# Altium schematic sheet 2017_Carte_RUSH.SchDoc
size A4
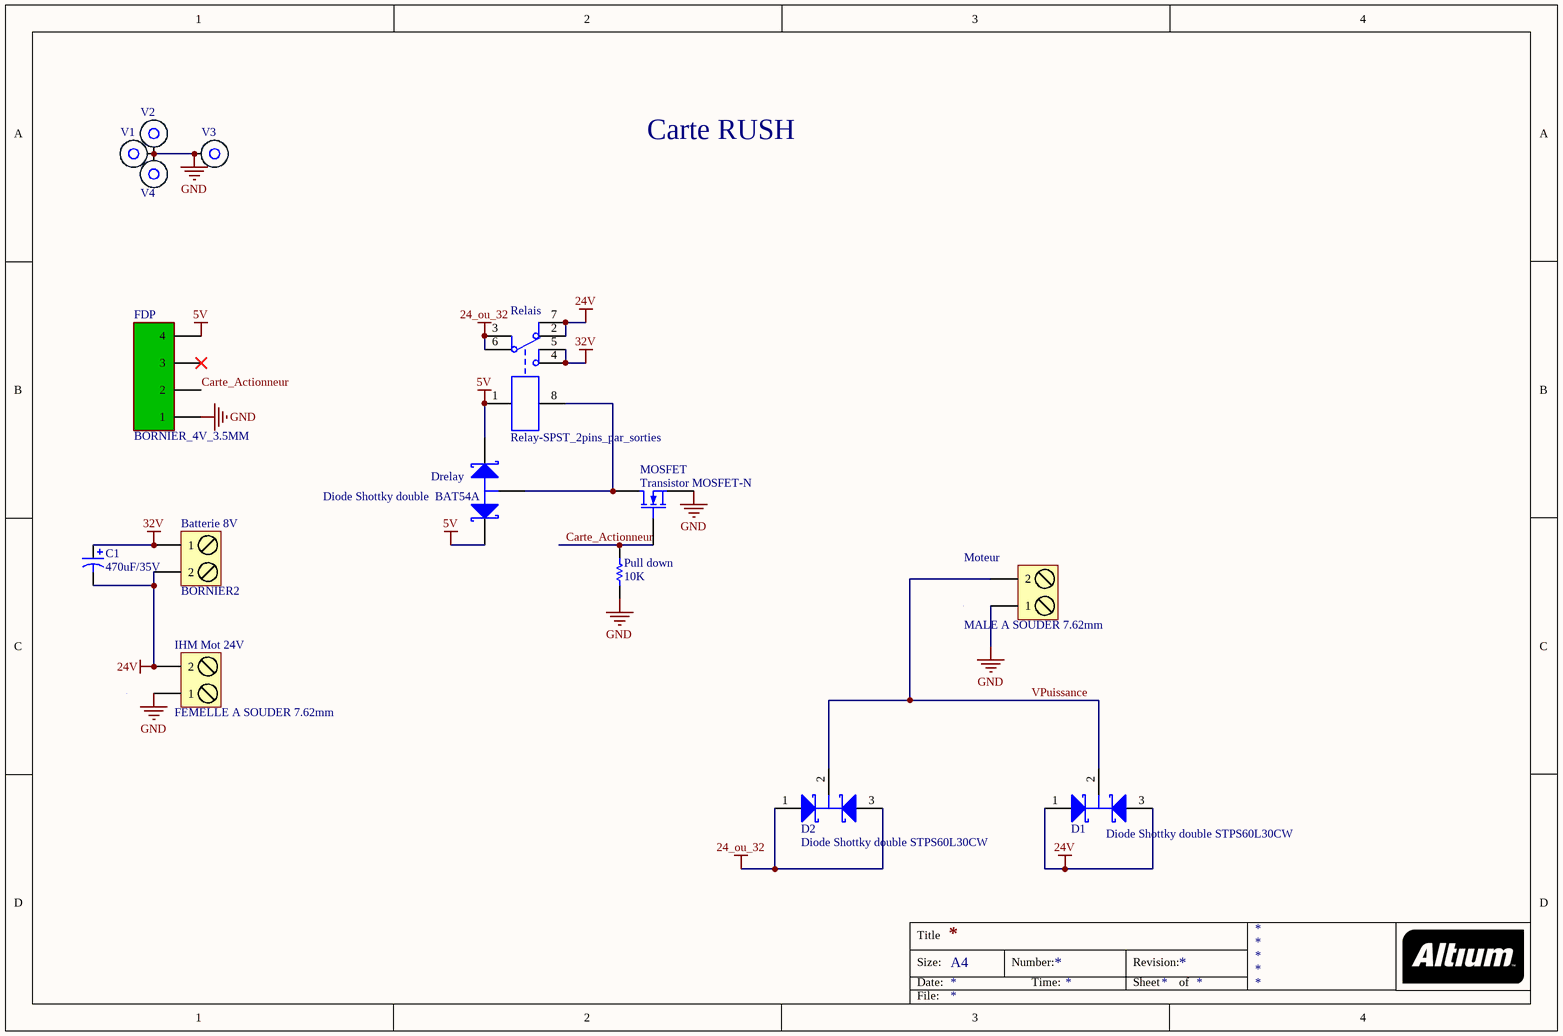
[diagram p0: 2017_Carte_RUSH.SchDoc]

## Parts
Batterie_8V  BORNIER2  [BORNIER_2V_5.08MM]
C1  470uF/35V  [C_10.3mm_G]
D1  Diode Shottky double STPS60L30CW  [TO247]
D2  Diode Shottky double STPS60L30CW  [TO247]
Drelay  Diode Shottky double  BAT54A  [SOT23-3N]
FDP  BORNIER_4V_3.5MM  [BORNIER_4V_3.5MM]
IHM_Mot_24V  FEMELLE A SOUDER 7.62mm  [BORNIER2_FEM_COUDE]
MOSFET  Transistor MOSFET-N  [SOT23-3N]
Moteur  MALE A SOUDER 7.62mm  [BORNIER2_FEM_HORIZ]
Pull_down  10K  [R1206_N]
Relais  Relay-SPST_2pins_par_sorties  [RELAY_TECONNECTIVITY]
V1  (no value)  [ENTRETOISE_CMS]
V2  (no value)  [ENTRETOISE_CMS]
V3  (no value)  [ENTRETOISE_CMS]
V4  (no value)  [ENTRETOISE_CMS]

## Nets
5V: Drelay.1(K1) Drelay.2(K2) FDP.4 Relais.1
24_ou_32: D2.1(A1) D2.3(A2) Relais.3 Relais.6
24V: Batterie_8V.2 C1.2 D1.1(A1) D1.3(A2) IHM_Mot_24V.2 Relais.2 Relais.7
32V: Batterie_8V.1 C1.1 Relais.4 Relais.5
GND: FDP.1 IHM_Mot_24V.1 MOSFET.2(S) Moteur.1 Pull_down.1 V1.1 V2.1 V3.1 V4.1
Carte_Actionneur: FDP.2 MOSFET.1(G) Pull_down.2
VPuissance: D1.2(K) D2.2(K) Moteur.2
NetDrelay_3: Drelay.3(A) MOSFET.3(D) Relais.8

Not connected (* = marked no-connect by the designer): FDP 3*

## Notes on the sheet
- Carte RUSH
- Title
- Size:
- Date:
- A4
- Number:
- Time:
- Revision:
- Sheet
- of
- File:

## Library data of the parts
Batterie_8V IHM_Mot_24V Moteur = BORNIER2: Terminal blocks, 2 pins, pitch=5mm
C1 = Condensateur Polarise CMS: Polarized Capacitor; Published: 8-Jun-2000; LatestRevisionDate: 17-Jul-2002; LatestRevisionNote: Re-released for DXP Platform.; PackageReference: POLAR0.8; Publisher: Altium Limited
D1 D2 = Diode Shottky double STPS60L30CW: DIODE SCHOTTKY DOUBLE; Manufacturer Part Number: BAT54C; Manufacturer: ZETEX; Diode Case Style: SOT-23; Supplier Part Number: 9526501; Supplier: Farnell; ComponentLink1URL: http://www.farnell.com/datasheets/27632.pdf; ComponentLink1Description: http://www.farnell.com/datasheets/27632.pdf; Pricing: 5=0,32, 25=0,23, 100=0,198, 1000=0,154 (EUR); RoHS: YES
Drelay = Diode Shottky double  BAT54A: DIODE SCHOTTKY DOUBLE; Manufacturer: ZETEX; ComponentLink1URL: http://www.farnell.com/datasheets/27632.pdf; ComponentLink1Description: http://www.farnell.com/datasheets/27632.pdf; Supplier Part Number: 9526498; Supplier: Farnell; RoHS: YES; Manufacturer Part Number: BAT54A
MOSFET = Transistor MOSFET-N: N-Channel MOSFET; PackageDocument: 1995/1996; Published: 8-Jun-2000; LatestRevisionDate: 17-Jul-2002; LatestRevisionNote: Re-released for DXP Platform.; PackageReference: E3; Publisher: Altium Limited
Pull_down = Resistor: Published: 8-Jun-2000; LatestRevisionDate: 17-Jul-2002; LatestRevisionNote: Re-released for DXP Platform.; PackageReference: AXIAL-0.5; Publisher: Altium Limited
Relais = Relay-SPST_2pins_par_sorties: OZ-SS-105LM1,200 - Single-Pole Single-Throw Relay; Published: 24-Mar-1999; LatestRevisionDate: 17-Jul-2002; LatestRevisionNote: Re-released for DXP Platform.; PackageReference: MODULE4; Publisher: Altium Limited
V1-V4 = Entretoise WURTH CMS: Entretoise Wurth; Publisher: Damien Guitton